# EAGLE design solar-shield (EAGLE 7.5.0)
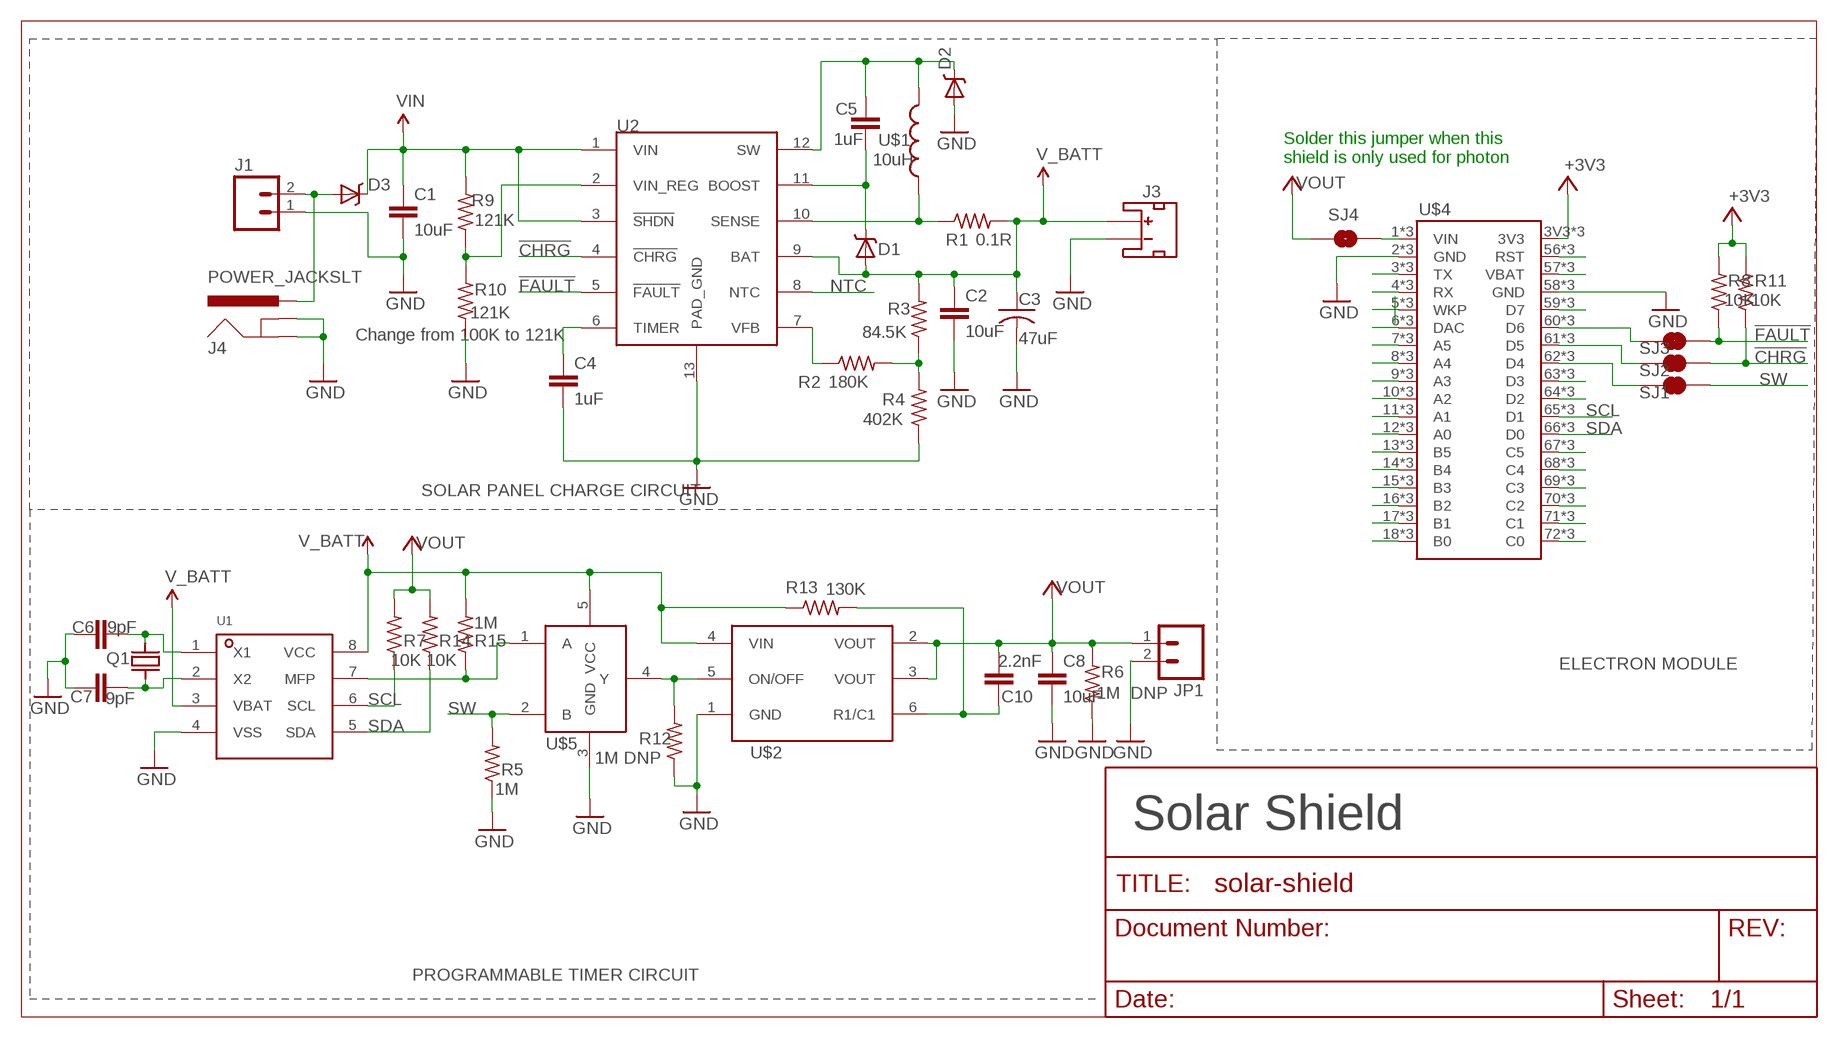
[diagram p0: schematic, sheet 1]

## Parts
C1  10uF  CAP_NONE_POLB  [1206]
C2  10uF  CAP_NONE_POLB  [1206]
C3  47uF  C-USB  [47U_TAN]
C4  1uF  CAP_NONE_POL  [0603]
C5  1uF  CAP_NONE_POL  [0603]
C6  9pF  CAP_NONE_POL  [0603]
C7  9pF  CAP_NONE_POL  [0603]
C8  10uF  CAP_NONE_POLA  [0805]
C10  2.2nF  CAP_NONE_POL  [0603]
D1  DIODE_SCHOTTKYD  [DIODE_SOD323]
D2  DIODE_SCHOTTKYA  [DIODE_SMA]
D3  DIODE_SCHOTTKYA  [DIODE_SMA]
J1  M025MM  [SCREWTERMINAL-5MM-2]
J3  JST_2MM_MALEA  [JST_2_MSD_VERT]
J4  POWER_JACKSLT  [POWER_JACK_SLOT]
JP1  M02PTH  [1X02]
Q1  Q_FC135  [FC135]
R1  0.1R  R-US_B  [R0805]
R2  180K  R_0603  [0603]
R3  84.5K  R_0603  [0603]
R4  402K  R_0603  [0603]
R5  1M  R_0603  [0603]
R6  1M DNP  R_0603  [0603]
R7  10K  R_0603  [0603]
R8  10K  R_0603  [0603]
R9  121K  R_0603  [0603]
R10  121K  R_0603  [0603]
R11  10K  R_0603  [0603]
R12  1M DNP  R_0603  [0603]
R13  130K  R_0603  [0603]
R14  10K  R_0603  [0603]
R15  1M  R_0603  [0603]
SJ1  JUMPER-PAD-2-NC_BY_TRACE  [PAD-JUMPER-2-NC_BY_TRACE_YES_SILK]
SJ2  JUMPER-PAD-2-NC_BY_TRACE  [PAD-JUMPER-2-NC_BY_TRACE_YES_SILK]
SJ3  JUMPER-PAD-2-NC_BY_TRACE  [PAD-JUMPER-2-NC_BY_TRACE_YES_SILK]
SJ4  JUMPER-PAD-2-NO  [PAD-JUMPER-2-NO_NO_SILK]
U1  RTC_MCP7941X  [RTC_MCP7941X]
U2  LT3652A  [DFN_3X3]
U$1  10uH  INDUCTORR  [INDUCTOR_NR6045T100M]
U$2  TPS27082L  [TPS27082L]
U$4  ELECTRONDUALROW  [ELECTRON_DUAL-ROW]
U$5  SN74UP1G32A  [SN74UP1G32_DBV]

## Nets
!CHRG: R11.1 SJ2.2 U2.4(!CHRG)
!FAULT: R8.1 SJ3.2 U2.5(!FAULT)
+3V3: R8.2 R11.2 U$4.3V3 U$4.55(3V3) U$4.91(3V3)
GND: C1.2(CATHODE) C2.2(CATHODE) C3.C C4.2(CATHODE) C6.1(ANODE) C7.1(ANODE) C8.2(CATHODE) D2.ANODE J1.1 J3.GND(-) J4.GND@1(GNDBREAK) J4.GND@2(GND) JP1.2 R4.1 R5.1 R6.1 R10.1 R12.1 U1.4(VSS) U2.13(PAD_GND) U$2.1(GND) U$4.2(GND) U$4.38(GND) U$4.58(GND) U$4.94(GND) U$4.GND U$4.GND@2(GND) U$5.3(GND)
N$1: R2.2 R3.1 R4.2
N$2: C5.2(CATHODE) D1.CATHODE U2.11(BOOST)
N$4: R1.1 U2.10(SENSE) U$1.P$1
N$5: R2.1 U2.7(VFB)
N$6: D3.ANODE J1.2 J4.PWR
N$7: C5.1(ANODE) D2.CATHODE U2.12(SW) U$1.P$2
N$10: U$4.3(TX) U$4.39(TX) U$4.TX
N$11: U$4.4(RX) U$4.40(RX) U$4.RX
N$12: U$4.5(WKP) U$4.41(WKP) U$4.WKP
N$13: U$4.6(DAC) U$4.42(DAC) U$4.DAC
N$14: U$4.7(A5) U$4.43(A5) U$4.A5
N$15: U$4.8(A4) U$4.44(A4) U$4.A4
N$16: U$4.9(A3) U$4.45(A3) U$4.A3
N$17: U$4.10(A2) U$4.46(A2) U$4.A2
N$18: U$4.11(A1) U$4.47(A1) U$4.A1
N$19: U$4.12(A0) U$4.48(A0) U$4.A0
N$20: U$4.13(B5) U$4.49(B5) U$4.B5
N$21: U$4.14(B4) U$4.50(B4) U$4.B4
N$22: U$4.15(B3) U$4.51(B3) U$4.B3
N$23: U$4.16(B2) U$4.52(B2) U$4.B2
N$24: U$4.17(B1) U$4.53(B1) U$4.B1
N$25: U$4.18(B0) U$4.54(B0) U$4.B0
N$26: U$4.72(C0) U$4.108(C0) U$4.C0
N$27: U$4.71(C1) U$4.107(C1) U$4.C1
N$28: U$4.70(C2) U$4.106(C2) U$4.C2
N$29: U$4.69(C3) U$4.105(C3) U$4.C3
N$30: U$4.68(C4) U$4.104(C4) U$4.C4
N$31: U$4.67(C5) U$4.103(C5) U$4.C5
N$32: SJ4.2 U$4.1(VIN) U$4.37(VIN) U$4.VIN
N$34: U$4.64(D2) U$4.100(D2) U$4.D2
N$35: U$4.59(D7) U$4.95(D7) U$4.D7
N$36: U$4.57(VBAT) U$4.93(VBAT) U$4.VBAT
N$37: U$4.56(RST) U$4.92(RST) U$4.RST
N$38: SJ1.1 U$4.62(D4) U$4.98(D4) U$4.D4
N$41: SJ2.1 U$4.61(D5) U$4.97(D5) U$4.D5
N$42: SJ3.1 U$4.60(D6) U$4.96(D6) U$4.D6
N$43: C6.2(CATHODE) Q1.X2 U1.1(X1)
N$44: C10.1(ANODE) R13.2 U$2.6(R1/C1)
N$46: C7.2(CATHODE) Q1.X1 U1.2(X2)
N$49: R15.1 U1.7(MFP) U$5.1(A)
N$51: R12.2 U$2.5(ON/OFF) U$5.4(Y)
NTC: U2.8(NTC)
SCL: R7.1 U1.6(SCL) U$4.65(D1) U$4.101(D1) U$4.D1
SDA: R14.1 U1.5(SDA) U$4.66(D0) U$4.102(D0) U$4.D0
SET: R9.1 R10.2 U2.2(VIN_REG)
SW: R5.2 SJ1.2 U$5.2(B)
TCAL: U$4.63(D3) U$4.99(D3) U$4.D3
TIMER: C4.1(ANODE) U2.6(TIMER)
V_BATT: C2.1(ANODE) C3.A D1.ANODE J3.VCC(+) R1.2 R3.2 R13.1 R15.2 U1.3(VBAT) U1.8(VCC) U2.9(BAT) U$2.4(VIN) U$5.5(VCC)
VCC: C8.1(ANODE) C10.2(CATHODE) JP1.1 R6.2 R7.2 R14.2 SJ4.1 U$2.2(VOUT) U$2.3(VOUT) ; supply symbol labelled VOUT
VIN: C1.1(ANODE) D3.CATHODE R9.2 U2.1(VIN) U2.3(!SHDN!)
Unconnected: J3.P$1(PAD1) J3.P$2(PAD2)

## Notes on the sheet
- Solder this jumper when this
  shield is only used for photon
- Change from 100K to 121K
- SOLAR PANEL CHARGE CIRCUIT
- ELECTRON MODULE
- Solar Shield
- PROGRAMMABLE TIMER CIRCUIT

## Library data of the parts
C1 C2 C4-C8 C10 = Particle:CAP_NONE_POL
C3 = Particle:C-US: Capacitor
D1-D3 = Particle:DIODE_SCHOTTKY
J1 = SparkFun-Connectors:M02: Standard 2-pin 0.1" header. Use with - straight break away headers ( PRT-00116) - right angle break away headers (PRT-00553) - swiss pins (PRT-00743) - machine pins (PRT-00117) - female headers (PRT-00115) Molex polarized connector foot print use with: PRT-08233 with associated crimp pins and housings. 2.54_SCREWTERM for use with PRT-10571. 3.5mm Screw Terminal footprints for PRT-08084 5mm Screw Terminal footprints for use with PRT-08432; STOREFRONT_ID: PRT-08432
J3 = Particle:JST_2MM_MALE
J4 = Particle:POWER_JACK: Power Jack This is the standard 5.5mm barrel jack for power. The PTH is the most common, proven, reliable, footprint. The Slot footprint only works if the mill layer is transmitted to the PCB fab house so be warned. Spark Fun Electronics SKU : PRT-00119 SMT: CONN-08106 Mating wall wart : TOL-00298 (and others)
JP1 = SparkFun-Connectors:M02: Standard 2-pin 0.1" header. Use with - straight break away headers ( PRT-00116) - right angle break away headers (PRT-00553) - swiss pins (PRT-00743) - machine pins (PRT-00117) - female headers (PRT-00115) Molex polarized connector foot print use with: PRT-08233 with associated crimp pins and housings. 2.54_SCREWTERM for use with PRT-10571. 3.5mm Screw Terminal footprints for PRT-08084 5mm Screw Terminal footprints for use with PRT-08432
Q1 = Particle:Q
R1 = Particle:R-US_: 0402 Resistor
R2-R15 = Particle:R_0603
SJ1-SJ3 = SparkFun-Passives:JUMPER-PAD-2-NC_BY_TRACE
SJ4 = SparkFun-Passives:JUMPER-PAD-2-NO
U1 = Particle:RTC_MCP7941X
U2 = Particle:LT3652
U$1 = Particle:INDUCTOR
U$2 = Particle:TPS27082L
U$4 = Particle:ELECTRON
U$5 = Particle:SN74UP1G32

## Board
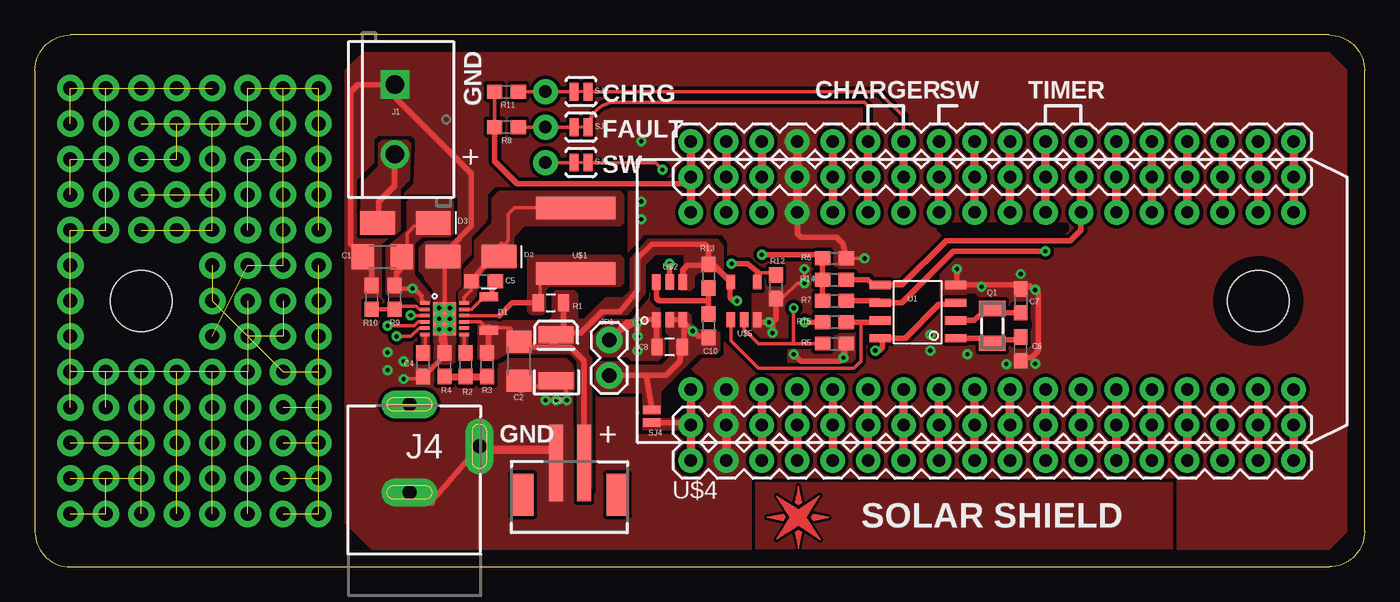
[diagram p1: board, top side]
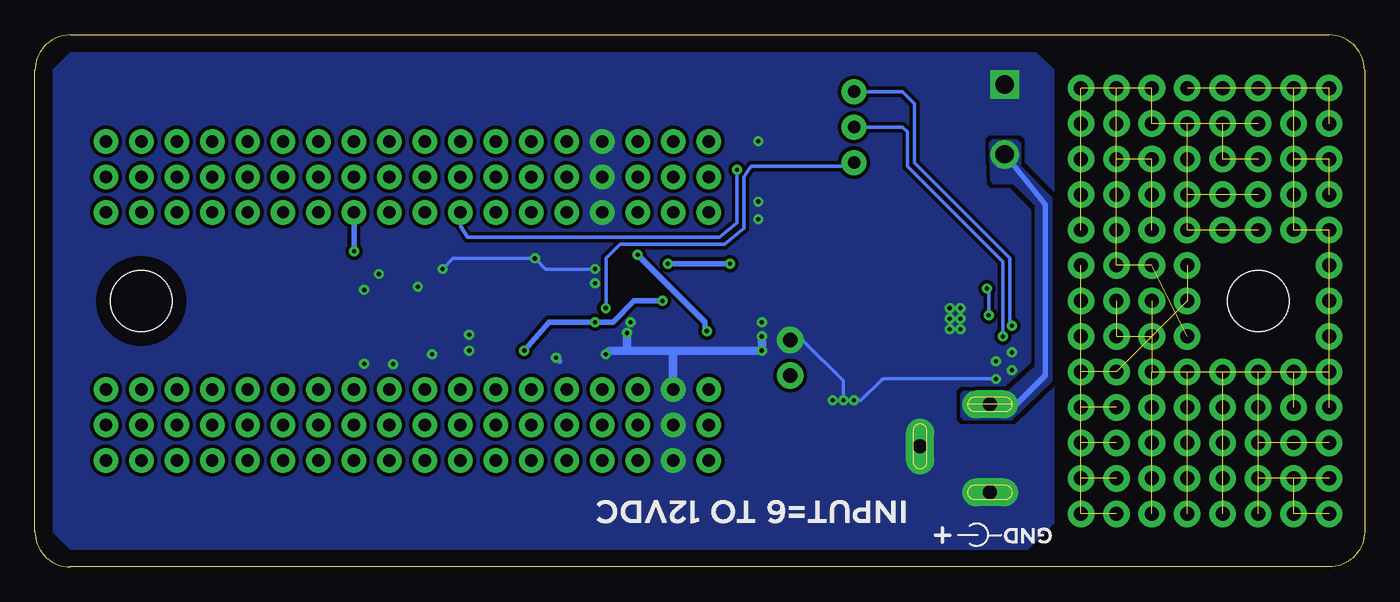
[diagram p2: board, bottom side, seen from below]

Size 95.25 x 38.1 mm. Coordinates in mm from the lower left corner, seen from the top.
Outline: 95.25,2.54 95.25,35.56 arc90 92.71,38.1 2.54,38.1 arc90 0,35.56 0,2.54 arc90 2.54,0 92.71,0 arc90 95.25,2.54
Copper layers (1*16): Top 0.035mm / dielectric 1.5mm / Bottom 0.035mm
Design rules "default *": minimum track width 10mil, minimum drill 24mil, track to track 8mil, track to pad 8mil, pad to pad 8mil, via to via 8mil, smd to smd 8mil, copper to edge 40mil, drill to drill 8mil, minimum pad ring 10mil, minimum via ring 8mil, stop-mask expansion 4mil, vias tented up to drill 20mil, thermal gap 10mil
Holes 4.4 mm at 7.62,19.05 87.63,19.05

### Footprints (pad centres in the part's own frame; a part is rotated, then mirrored left to right if it is on the bottom)
1206 = smd 1.6 x 1.8: 1 -1.4,0; 2 1.4,0
47U_TAN = smd 1.2 x 2.5: A 1.65,0; C -1.65,0
0603 = smd 1.1 x 1: 1 -0.85,0; 2 0.85,0
0805 = smd 0.8 x 1.2: 1 -0.9,0; 2 0.9,0
DIODE_SOD323 = smd 0.65 x 1.35: ANODE 1.2,0; CATHODE -1.2,0
DIODE_SMA = smd 2.5 x 1.7: ANODE 2,0; CATHODE -2,0
SCREWTERMINAL-5MM-2 = drill 1.3 pad 2.032 square: 1 0,0 | drill 1.3 pad 2.032: 2 5,0
JST_2_MSD_VERT = smd 1 x 5.5: GND 1.145,-0.965; VCC -0.855,-0.965 | smd 1.6 x 3: P$1 -3.255,1.305; P$2 3.545,1.305
POWER_JACK_SLOT = drill 1 pad 2 long: GND@1 2.58,7.5; GND@2 7.58,10.8; PWR 2.58,13.8
1X02 = drill 1.016 pad 1.88: 1 0,0; 2 2.54,0
FC135 = smd 1.1 x 1.9: X1 -1.25,0; X2 1.25,0
R0805 = smd 0.8 x 1.2: 1 -0.9,0; 2 0.9,0
PAD-JUMPER-2-NC_BY_TRACE_YES_SILK = smd 0.635 x 1.27: 1 -0.508,0; 2 0.508,0
PAD-JUMPER-2-NO_NO_SILK = smd 0.635 x 1.27: 1 -0.45,0; 2 0.45,0
RTC_MCP7941X = smd 0.6 x 1.55: 1 -1.905,-2.7; 2 -0.635,-2.7; 3 0.635,-2.7; 4 1.905,-2.7; 5 1.905,2.7; 6 0.635,2.7; 7 -0.635,2.7; 8 -1.905,2.7
DFN_3X3 = smd 0.25 x 0.7: 1 -1.125,-1.4; 2 -0.675,-1.4; 3 -0.225,-1.4; 4 0.225,-1.4; 5 0.675,-1.4; 6 1.125,-1.4; 7 1.125,1.4; 8 0.675,1.4; 9 0.225,1.4; 10 -0.225,1.4; 11 -0.675,1.4; 12 -1.125,1.4 | smd 2.38 x 1.65: 13 0,0
INDUCTOR_NR6045T100M = smd 1.6 x 5.7: P$1 -2.35,0; P$2 2.35,0
TPS27082L = smd 0.6 x 1.1: 1 -0.95,-1.35; 2 0,-1.35; 3 0.95,-1.35; 4 0.95,1.35; 5 0,1.35; 6 -0.95,1.35
ELECTRON_DUAL-ROW = drill 0.889 pad 1.753: 1 1.27,2.54; 2 3.81,2.54; 3 6.35,2.54; 3V3 1.27,22.86; 4 8.89,2.54; 5 11.43,2.54; 6 13.97,2.54; 7 16.51,2.54; 8 19.05,2.54; 9 21.59,2.54; 10 24.13,2.54; 11 26.67,2.54; 12 29.21,2.54; 13 31.75,2.54; 14 34.29,2.54; 15 36.83,2.54; 16 39.37,2.54; 17 41.91,2.54; 18 44.45,2.54; 37 1.27,7.62; 38 3.81,7.62; 39 6.35,7.62; 40 8.89,7.62; 41 11.43,7.62; 42 13.97,7.62; 43 16.51,7.62; 44 19.05,7.62; 45 21.59,7.62; 46 24.13,7.62; 47 26.67,7.62; 48 29.21,7.62; 49 31.75,7.62; 50 34.29,7.62; 51 36.83,7.62; 52 39.37,7.62; 53 41.91,7.62; 54 44.45,7.62; 55 1.27,20.32; 56 3.81,20.32; 57 6.35,20.32; 58 8.89,20.32; 59 11.43,20.32; 60 13.97,20.32; 61 16.51,20.32; 62 19.05,20.32; 63 21.59,20.32; 64 24.13,20.32; 65 26.67,20.32; 66 29.21,20.32; 67 31.75,20.32; 68 34.29,20.32; 69 36.83,20.32; 70 39.37,20.32; 71 41.91,20.32; 72 44.45,20.32; 91 1.27,25.4; 92 3.81,25.4; 93 6.35,25.4; 94 8.89,25.4; 95 11.43,25.4; 96 13.97,25.4; 97 16.51,25.4; 98 19.05,25.4; 99 21.59,25.4; 100 24.13,25.4; 101 26.67,25.4; 102 29.21,25.4; 103 31.75,25.4; 104 34.29,25.4; 105 36.83,25.4; 106 39.37,25.4; 107 41.91,25.4; 108 44.45,25.4; A0 29.21,5.08; A1 26.67,5.08; A2 24.13,5.08; A3 21.59,5.08; A4 19.05,5.08; A5 16.51,5.08; B0 44.45,5.08; B1 41.91,5.08; B2 39.37,5.08; B3 36.83,5.08; B4 34.29,5.08; B5 31.75,5.08; C0 44.45,22.86; C1 41.91,22.86; C2 39.37,22.86; C3 36.83,22.86; C4 34.29,22.86; C5 31.75,22.86; D0 29.21,22.86; D1 26.67,22.86; D2 24.13,22.86; D3 21.59,22.86; D4 19.05,22.86; D5 16.51,22.86; D6 13.97,22.86; D7 11.43,22.86; DAC 13.97,5.08; GND 8.89,22.86; GND@2 3.81,5.08; RST 3.81,22.86; RX 8.89,5.08; TX 6.35,5.08; VBAT 6.35,22.86; VIN 1.27,5.08; WKP 11.43,5.08
SN74UP1G32_DBV = smd 0.6 x 1.05: 1 -0.95,-1.35; 2 0,-1.35; 3 0.95,-1.35; 4 0.95,1.35; 5 -0.95,1.35

### Placement (x,y rotation side)
C1  24.89,22.23 180 top
C2  34.67,14.73 270 top
C3  37.34,14.99 90 top
C4  27.81,14.48 270 top
C5  32.13,20.45 0 top
C6  70.61,15.62 90 top
C7  70.61,19.05 270 top
C8  45.47,15.75 180 top
C10  48.26,17.27 270 top
D1  32.51,18.16 270 top
D2  31.24,22.23 180 top
D3  26.54,24.64 180 top
J1  25.78,34.54 270 top
J3  38.48,6.48 180 top
J4  24.26,-2.16 0 top
JP1  41.15,13.72 90 top
Q1  68.58,17.27 270 top
R1  36.96,18.92 0 top
R2  30.86,14.48 270 top
R3  32.38,14.48 90 top
R4  29.34,14.48 270 top
R5  57.28,16 180 top
R6  57.28,22.1 180 top
R7  57.28,19.05 180 top
R8  33.78,31.5 180 top
R9  25.78,19.3 90 top
R10  24.13,19.3 270 top
R11  33.78,34.04 180 top
R12  53.09,20.07 90 top
R13  48.26,20.83 270 top
R14  57.28,20.57 180 top
R15  57.28,17.53 180 top
SJ1  39.12,28.96 180 top
SJ2  39.12,34.04 180 top
SJ3  39.12,31.5 180 top
SJ4  44.2,10.79 270 top
U1  63.25,18.29 90 top
U2  29.34,17.78 270 top
U$1  38.73,23.37 90 top
U$2  45.47,19.05 0 top
U$3  [SPARK_LOGO_PLUS_PLANE]  54.69,3.56 0 top
U$4  45.72,5.08 0 top
U$5  50.8,19.05 0 top

### Tracks (layer width: path | path; a pad name or v marks a point on that pad's centre or on a via)
!CHRG  (via drill 0.3 pad 0.61, 0.9 pad 1.8)
  Top 0.254: U2.4 27.46,17.55 27.18,17.27 v25.27,17.27 | R11.1 v36.58,34.04 SJ2.2
  Bottom 0.254: v36.58,34.04 33.11,34.04 32.26,33.19 32.26,28.96 25.4,22.1 25.4,17.4 v25.27,17.27
!FAULT  (via drill 0.3 pad 0.61, 0.9 pad 1.8)
  Top 0.254: U2.5 27.52,17.11 26.92,16.51 v25.91,16.51 | SJ3.2 v36.58,31.5 R8.1
  Bottom 0.254: v25.91,16.51 25.91,21.84 32.77,28.7 32.77,31.15 33.11,31.5 v36.58,31.5
+3V3
  Top 0.254: R11.2 R8.2
  Top 0.406: 46.99,27.43 34.54,27.43 32.93,29.04 R8.2
  Top 0.61: U$4.91 U$4.3V3 46.99,27.43 U$4.55
GND  (via drill 0.3 pad 0.61)
  Top 0.025: R4.1 29.08,15.03
  Top 0.254: v59.44,22.1 R6.1 | R12.1 53.34,19.3 53.59,19.3 54.61,20.32 v55.12,20.32 v55.12,21.34 | 27.69,13.46 27.56,13.46 v26.42,13.46 | v36.58,11.94 v37.34,11.94 | v38.1,11.94 38.1,12.47 arc45 38.03,12.65 C3.C
  Top 0.305: U2.13 29.34,22.8 D2.ANODE | C3.C 34.79,12.57 C2.2 | R4.1 29.08,15.07 29.08,14.86 27.85,13.63 C4.2 27.73,13.63 27.56,13.46
  Top 0.406: R10.1 24.13,22.23 C1.2 22.61,23.11 22.61,34.04 23.11,34.54 J1.1 25.78,33.66 31.24,28.19 31.24,24.38 29.59,22.73 D2.ANODE | 50.04,12.95 49.78,12.95 U$4.38 | C6.1 70.83,14.99 71.37,14.99 71.88,15.49 71.88,19.56 71.29,20.15 C7.1 70.57,20.19 U1.4 66.04,20.29 v66.04,21.34 | C8.2 44.52,16.16 U$2.1 44.44,17.78 42.42,17.53 JP1.2 41.66,16.76 v43.18,17.53 v43.18,16.51 | J4.GND@1 26.83,4.57 28.45,4.57 28.45,4.74 J4.GND@2 31.96,8.01 32.34,8.38 | R6.1 57.87,23.15 57.4,23.62 54.86,23.62 54.61,23.88 54.61,25.65 | R12.1 53.09,17.78 52.83,17.53 | 52.83,17.53 51.92,17.53 | 51.92,17.53 U$5.3 51.75,17.59 51.82,17.53 51.92,17.53 | 52.83,17.53 v52.83,16.76 | R5.1 57.87,14.95 | v54.36,15.24 54.86,14.73 57.66,14.73 57.87,14.95 | 57.87,14.95 v57.91,14.99
  Top 0.61: U$4.94 U$4.GND 54.61,25.65 U$4.58 | U$4.38 U$4.GND@2 U$4.2 | J3.GND 37.34,8.13 37.08,8.38 32.34,8.38 | R4.1 29.08,17.53 U2.13
  Bottom 0.254: v66.04,21.34 65.28,22.1 v59.44,22.1 58.67,21.34 v55.12,21.34 | v26.42,13.46 34.44,13.46 arc-45 34.62,13.39 36.07,11.94 v36.58,11.94 | v38.1,11.94 v37.34,11.94 C3.C 40.18,16.18 arc-45 40.36,16.26 40.89,16.26
  Bottom 0.406: JP1.2 40.89,16.26 | v57.91,14.99 57.66,14.73
  Bottom 0.61: 49.66,15.49 v43.18,15.49 v43.18,16.51 | 49.66,15.49 52.83,15.49 | 52.83,15.49 54.1,15.49 v54.36,15.24 | v52.83,16.76 52.83,15.49 | U$4.38 49.53,15.37 49.66,15.49
  other vias: 67.82,20.07 66.8,15.24 28.96,18.54 29.72,18.54 29.72,17.78 28.96,17.78 28.96,17.02 29.72,17.02 52.58,17.53 26.42,14.73 25.27,15.37 25.27,14.1 43.43,30.48 64.14,16.64 64.14,15.49 43.43,30.48 43.43,26.16 43.43,24.89 70.61,20.98 71.65,14.55 69.6,14.53 71.65,19.84
  pour Top (no thermals): 24.77,35.69 26.42,35.69 32.26,28.96 32.26,24.64 31.24,23.62 31.24,22.35 30.48,21.59 30.48,20.07 30.1,19.68 30.1,16.13 29.84,15.88 29.84,14.73 28.83,14.73 28.83,15.88 28.57,16.13 28.57,19.81 27.94,20.57 27.94,22.86 30.48,22.86 30.48,28.19 25.53,33.27 24.77,33.27 24.51,33.53 24.51,35.43
  pour Top (no thermals): 33.78,14.35 38.35,14.35 38.61,14.1 38.61,12.7 37.85,11.68 37.85,6.6 37.08,5.84 36.83,5.84 36.83,10.67 35.81,11.68 34.29,11.68 33.53,12.45 33.53,14.1
  pour Top (no thermals): 27.94,22.86 27.94,23.11 28.19,23.37 29.97,23.37 30.48,23.88 30.48,22.86
  pour Top (isolate 0.254, rank 2, no thermals): 37.47,1.27 92.71,1.27 93.98,2.54 93.98,35.56 92.71,36.83 23.5,36.83 22.23,35.56 22.23,3.17 24.13,1.27
  pour Top (isolate 0.508, rank 2, no thermals): 31.75,36.83 92.71,36.83 93.98,35.56 93.98,2.54 92.71,1.27 24.13,1.27 22.86,2.54 22.23,3.17 22.23,35.56 23.5,36.83
  pour Bottom (isolate 0.254, rank 2, no thermals): 23.62,36.83 92.71,36.83 93.98,35.56 93.98,2.54 92.71,1.27 24.13,1.27 22.23,3.17 22.23,35.56 23.5,36.83
N$1
  Top 0.508: R4.2 R2.2 R3.1
N$2
  Top 0.254: C5.2 32.98,20.28 32.77,20.07 | D1.CATHODE 32.19,19.36 31.28,18.45 U2.11
  Top 0.406: 32.77,20.07 32.77,19.61 D1.CATHODE
N$4
  Top 0.254: U$1.P$1 37.86,21.02 37.86,20.7 36.2,20.7 36.2,19.06 R1.1 | U2.10 33.27,18
  Top 0.406: R1.1 34.19,18.92 33.27,18
  pour Top (no thermals): 35.56,22.35 41.91,22.35 42.16,22.1 42.16,20.32 41.91,20.07 36.83,20.07 36.58,19.81 36.58,18.29 36.32,18.03 35.56,18.03 35.31,18.29 35.31,22.1
N$5
  Top 0.254: U2.7 30.74,15.08
  Top 0.305: 30.74,15.08 R2.1
  pour Top (no thermals): 30.48,16.64 30.99,16.64 30.99,15.37 30.48,15.37
N$6
  Top 0.406: J1.2 25.78,27.3 24.64,26.16 24.64,24.73 D3.ANODE
  Bottom 0.406: J1.2 22.86,25.93 22.86,13.72 24.89,11.68 26.79,11.68 J4.PWR
  pour Top (no thermals): 24.89,30.61 26.67,30.61 26.92,30.35 26.8,27.69 26.16,27.05 26.16,24.13 25.91,23.88 23.62,23.88 23.37,24.13 23.37,27.43 24.64,28.7 24.64,30.35
  pour Bottom (no thermals): 24.89,30.61 26.67,30.61 26.92,30.35 26.8,27.69 26.54,27.43 25.15,27.43 23.62,25.91 23.62,14.35 25.53,12.57 28.7,12.57 28.96,12.32 28.96,10.79 28.7,10.54 25.27,10.54 22.35,13.34 22.35,26.42 24.64,28.7 24.64,30.35
N$7
  Top 0.254: U$1.P$2 34.35,25.72 33.91,25.27 33.91,23.4 D2.CATHODE | U2.12 30.74,19.31 31.24,19.81 31.24,20.41 C5.1
  Top 0.406: D2.CATHODE 33.44,23.11 C5.1
  pour Top (no thermals): 31.5,23.37 32.77,24.64 32.77,26.42 33.27,26.92 41.91,26.92 42.16,26.67 42.16,24.64 41.91,24.38 35.05,24.38 34.29,23.62 34.29,21.84 32.51,21.59 31.62,20.57 31.62,19.43 31.11,18.8 30.35,18.8 30.35,19.68 30.73,20.07 30.73,21.34 31.5,22.1
N$8
  Top 0.406: 49.53,12.83 49.53,12.95
N$10
  Top 0.61: U$4.39 U$4.TX U$4.3
N$11
  Top 0.61: U$4.40 U$4.RX U$4.4
N$12
  Top 0.61: U$4.41 U$4.WKP U$4.5
N$13
  Top 0.61: U$4.42 U$4.DAC U$4.6
N$14
  Top 0.61: U$4.43 U$4.A5 U$4.7
N$15
  Top 0.61: U$4.44 U$4.A4 U$4.8
N$16
  Top 0.61: U$4.45 U$4.A3 U$4.9
N$17
  Top 0.61: U$4.46 U$4.A2 U$4.10
N$18
  Top 0.61: U$4.47 U$4.A1 U$4.11
N$19
  Top 0.61: U$4.48 U$4.A0 U$4.12
N$20
  Top 0.61: U$4.49 U$4.B5 U$4.13
N$21
  Top 0.61: U$4.50 U$4.B4 U$4.14
N$22
  Top 0.61: U$4.51 U$4.B3 U$4.15
N$23
  Top 0.61: U$4.52 U$4.B2 U$4.16
N$24
  Top 0.61: U$4.53 U$4.B1 U$4.17
N$25
  Top 0.61: U$4.54 U$4.B0 U$4.18
N$26
  Top 0.61: U$4.108 U$4.C0 U$4.72
N$27
  Top 0.61: U$4.107 U$4.C1 U$4.71
N$28
  Top 0.61: U$4.106 U$4.C2 U$4.70
N$29
  Top 0.61: U$4.105 U$4.C3 U$4.69
N$30
  Top 0.61: U$4.104 U$4.C4 U$4.68
N$31
  Top 0.61: U$4.103 U$4.C5 U$4.67
N$32
  Top 0.406: SJ4.2 46.8,10.35 U$4.VIN
  Top 0.61: U$4.37 U$4.VIN U$4.1
  pour Top (no thermals): 43.56,10.67 46.99,10.67 46.99,9.78 43.56,9.78
N$33  (via drill 1 pad 1.9)  (14 unrouted)
  other vias: 20.32,13.97 20.32,11.43 20.32,8.89 20.32,6.35 20.32,3.81 17.78,3.81 17.78,6.35 17.78,8.89 17.78,11.43 17.78,13.97 20.32,19.05 20.32,16.51 12.7,21.59 12.7,19.05 20.32,21.59
N$34
  Top 0.61: U$4.100 U$4.D2 U$4.64
N$35
  Top 0.61: U$4.95 U$4.D7 U$4.59
N$36
  Top 0.61: U$4.93 U$4.VBAT U$4.57
N$37
  Top 0.61: U$4.92 U$4.RST U$4.56
N$38  (via drill 0.3 pad 0.61)
  Top 0.254: SJ1.1 44.45,28.96 v44.96,28.45
  Top 0.61: U$4.98 U$4.D4 U$4.62
  Bottom 0.254: U$4.62 64.77,24.38 64.26,23.62 46.23,23.62 44.96,24.64 v44.96,28.45
N$39  (via drill 1 pad 1.9)  (49 unrouted)
  other vias: 5.08,13.97 7.62,13.97 7.62,11.43 7.62,8.89 7.62,6.35 5.08,11.43 5.08,8.89 5.08,6.35 5.08,3.81 7.62,3.81 2.54,3.81 2.54,6.35 2.54,8.89 2.54,11.43 2.54,13.97 10.16,11.43 10.16,8.89 10.16,6.35 10.16,3.81 12.7,3.81 12.7,6.35 12.7,8.89 12.7,11.43 12.7,13.97 15.24,11.43 15.24,8.89 15.24,6.35 15.24,3.81 2.54,34.29 5.08,34.29 7.62,34.29 10.16,34.29 12.7,34.29 5.08,29.21 2.54,29.21 5.08,31.75 2.54,31.75 5.08,26.67 5.08,24.13 2.54,24.13 2.54,26.67 2.54,19.05 2.54,16.51 2.54,21.59 10.16,13.97 15.24,13.97 15.24,16.51 17.78,16.51 17.78,19.05 15.24,19.05
N$40  (via drill 1 pad 1.9)  (29 unrouted)
  other vias: 10.16,31.75 12.7,31.75 12.7,29.21 12.7,26.67 12.7,24.13 10.16,29.21 10.16,26.67 10.16,24.13 12.7,16.51 15.24,21.59 17.78,21.59 7.62,24.13 7.62,26.67 7.62,29.21 7.62,31.75 15.24,29.21 15.24,26.67 15.24,24.13 15.24,34.29 17.78,34.29 17.78,24.13 17.78,26.67 17.78,29.21 17.78,31.75 20.32,29.21 20.32,26.67 20.32,24.13 20.32,34.29 15.24,31.75 20.32,31.75
N$41
  Top 0.254: U$4.97 62.23,32.26 62.1,32.37 60.44,34.04 SJ2.1
  Top 0.61: U$4.97 U$4.D5 U$4.61
N$42
  Top 0.254: U$4.96 59.69,33.02 59.44,33.27 41.91,33.27 arc90 SJ3.1
  Top 0.61: U$4.96 U$4.D6 U$4.60
N$43
  Top 0.406: U1.1 68.22,16.38 Q1.X2 68.81,16.26 70.48,16.26 70.61,16.38 C6.2
N$44
  Top 0.406: R13.2 48.26,19.05 | 48.26,19.05 C10.1 | U$2.6 44.52,19.24 44.7,19.05 48.26,19.05
N$46
  Top 0.406: 68.65,18.45 Q1.X1 | U1.2 67.31,17.65 67.94,18.29 68.35,18.29 Q1.X1 | C7.2 68.9,18.2 Q1.X1
N$47
  cutout Top (no thermals): 50.55,16.51 50.8,16.51 51.69,15.75 53.85,15.75 53.85,14.48 52.07,14.48 50.29,16.26 50.29,16.76
N$48
  cutout Top: 62.23,18.54 64.77,21.08 64.77,19.05 64.52,19.05 62.1,16.76 61.47,16.76 61.47,18.29 61.72,18.54
N$49
  Top 0.254: U$5.1 49.85,16.19 51.82,14.22 58.67,14.22 59.18,14.73 59.18,17.53
  Top 0.406: U1.7 60.42,17.53 59.18,17.53 R15.1
N$50
  cutout Top: 50.8,21.59 51.31,21.08 51.31,18.29 50.8,18.29 50.8,19.3 50.55,19.56 50.55,20.83 50.29,21.08
N$51  (via drill 0.3 pad 0.61)
  Top 0.254: R12.2 53.34,20.83 53.09,21.08 51.82,21.08 51.75,21.15
  Top 0.406: U$2.5 v45.47,21.72 | v49.91,21.72 51.05,21.72 51.75,21.15 U$5.4
  Bottom 0.406: v45.47,21.72 v49.91,21.72
N$52
  cutout Top: 68.07,17.78 71.12,17.78 71.37,17.53 71.37,17.14 70.23,17.14 69.98,16.89 69.98,16.76 69.85,16.64 65.02,16.64 64.9,16.76 64.9,18.54 65.15,18.54 65.15,17.27 65.28,17.14 66.8,17.14 66.93,17.27 67.44,17.27 67.94,17.78
N$53
  cutout Top: 49.53,16.89 49.53,16.13 49.28,16.13 49.15,16.26 49.15,16.89
N$54
  cutout Top: 44.83,18.8 44.83,18.29 44.96,18.16 45.21,18.41 45.21,18.67 44.96,18.67
N$55
  cutout Top: 66.8,19.56 67.31,19.56 67.56,19.3 67.56,18.54 67.31,18.03 66.8,18.03
N$56
  cutout Top: 39.12,28.7 43.94,28.7 43.94,27.94 39.12,27.94
N$57
  cutout Top: 65.28,24.64 73.91,24.64 74.04,24.51 74.04,24.13 73.66,23.75 65.02,23.75 64.64,24.13 64.64,24.38 64.9,24.64 65.41,24.64
N$59
  cutout Top: 42.42,25.02 42.42,22.23 42.16,22.23 41.4,22.99 41.4,23.75 42.04,24.38 42.29,24.64 42.29,24.89
N$60
  cutout Top: 30.35,14.61 33.15,14.61 33.15,14.22 30.1,14.22 29.97,14.35 29.97,14.48 30.23,14.73
N$61
  cutout Top: 46.86,13.84 46.61,14.22 46.74,14.35 47.24,13.84 47.12,13.59
N$62
  cutout Top: 57.02,21.46 57.4,21.46 57.53,21.34 57.53,16.76 57.4,16.64 57.02,16.64
N$63
  pour Top: 51.66,6.07 81.48,6.07 81.48,1.27 51.66,1.27
SCL  (via drill 0.3 pad 0.61)
  Top 0.406: R7.1 60.42,19.05 U1.6 62.1,18.92 65.79,22.61 v72.39,22.61
  Top 0.61: U$4.101 U$4.D1 U$4.65
  Bottom 0.406: v72.39,22.61 U$4.65
SDA
  Top 0.406: U$4.66 74.93,24.13 74.17,23.37 65.28,23.37 62.1,20.19 U1.5 60.07,20.19 59.69,20.57 R14.1
  Top 0.61: U$4.102 U$4.D0 U$4.66
SET
  Top 0.254: U2.2 27.52,18.45 27.3,18.67 26,18.67 R9.1
  Top 0.305: R9.1 R10.2
SW  (via drill 0.3 pad 0.61, 0.9 pad 1.8)
  Top 0.254: 56.17,15.75 R5.2 54.36,16 | U$5.2 50.8,17.02 51.82,16 54.36,16 | SJ1.2 v36.58,28.96 | v54.36,18.54 54.36,16
  Bottom 0.254: v36.58,28.96 37.34,28.7 43.94,28.7 44.45,27.94 44.45,24.26 45.85,23.11 53.34,23.11 54.36,22.1 v54.36,18.54
TCAL
  Top 0.61: U$4.99 U$4.D3 U$4.63
TIMER
  Top 0.254: U2.6 27.94,15.32 C4.1
  pour Top (no thermals): 28.19,16.64 28.19,15.75 27.69,15.75 27.69,16.64
V_BATT  (via drill 0.3 pad 0.61)
  Top 0.025: R1.2 37.86,16.77 37.85,16.76
  Top 0.254: U2.9 31.92,17.55 D1.ANODE 32.84,17.14 33.91,17.14 34.04,17.02 34.04,16.38 34.42,16 C2.1
  Top 0.406: 32.51,17.21 D1.ANODE 32.51,15.58 R3.2 32.26,15.07 | C3.A 37.21,15.75 38.35,15.75 39.34,14.77 J3.VCC | U1.3 65.82,18.8 64.77,18.8 62.36,16.38 U1.8 60.71,16.22 60.71,15.75 60.45,15.49 v60.2,15.49 | 34.04,17.02 34.04,16 34.29,15.75 36.96,15.75 C3.A | U$2.4 46.42,21.27 46.74,21.59 48.17,21.59 R13.1 | R13.1 48.57,21.68 U$5.5 49.78,20.33 49.78,19.3 50.04,19.05 v50.29,19.05 | R15.2 v55.12,17.53 | R1.2 37.86,17.16 C3.A | 37.85,16.76 39.12,16.76 40.64,18.29 41.91,18.29 43.18,19.81 43.18,22.1 44.2,23.11 48.01,23.11 48.26,22.86 R13.1
  Bottom 0.406: v50.29,19.05 52.32,19.05 53.85,17.53 v55.12,17.53 58.42,17.53 v60.2,15.49
  pour Top (no thermals): 37.34,19.81 38.61,19.81 38.86,19.56 38.86,16 39.88,14.99 39.88,5.59 39.37,5.08 39.37,9.65 38.86,10.16 38.86,14.73 38.35,15.24 33.78,15.24 33.15,14.86 31.75,14.86 31.75,17.65 36.83,17.65 37.08,17.91 37.08,19.56
  pour Top (no thermals): 38.61,17.27 38.61,17.53 38.86,17.78 39.37,17.78 40.89,19.3 42.16,19.3 42.67,19.81 42.67,22.1 43.94,23.5 48.9,23.5 49.28,22.99 49.28,21.34 49.02,21.08 47.5,21.08 47.5,22.35 44.45,22.35 43.69,21.59 43.69,19.56 42.42,18.03 40.89,18.03 39.62,16.76 39.62,15.11 38.86,15.11 38.35,16.26 38.35,17.02
  pour Top (no thermals): 46.48,22.35 46.48,21.59 46.23,21.34 46.23,19.81 46.99,19.81 47.24,20.07 47.24,20.83 47.5,21.08 47.5,22.35
VCC  (via drill 0.3 pad 0.61)
  Top 0.406: 47.95,16.42 C10.2 48.17,16.51 47.5,16.51 v47.12,16.89 46.42,17.59 U$2.3 | U$2.2 U$2.3 | R7.2 R14.2 R6.2 55.92,22.35 v52.07,22.35 | U$2.3 46.48,17.63 46.48,16.26 46.1,15.88 C8.1 46.19,14.69 45.21,13.72 43.69,13.72 | JP1.1 43.69,13.72 | SJ4.1 43.81,13.59 43.69,13.72
  Bottom 0.406: v47.12,16.89 47.24,17.02 47.24,17.53 v52.07,22.35
  pour Top (no thermals): 45.34,18.29 46.74,18.29 46.99,18.03 46.99,17.53 47.5,17.02 48.77,17.02 49.02,16.76 49.02,15.49 48.77,15.24 47.5,15.24 44.7,12.45 40.64,12.45 40.13,12.95 40.13,14.48 40.39,14.73 42.16,14.73 42.42,14.48 44.96,14.48 45.47,14.99 45.47,16.51 45.21,16.76 45.21,18.16
  pour Top (no thermals): 44.83,12.95 44.83,11.43 43.56,11.43 43.56,12.95
VIN  (via drill 0.3 pad 0.61)
  Top 0.254: U2.3 26.95,18 v26.92,18.03 | D3.CATHODE 27.18,24.38 26.67,23.88 26.67,22.6 C1.1 | 27.69,19.43 27.69,19.16 U2.1
  Top 0.305: R9.2 26.07,19.94 v27.05,19.94 27.18,19.94 27.69,19.43
  Top 0.406: C1.1 26.8,21.97 25.91,21.08 25.91,20.28 R9.2
  Bottom 0.254: v26.92,18.03 26.92,19.81 v27.05,19.94
  pour Top (no thermals): 26.92,26.42 29.72,26.42 29.97,26.16 29.97,23.88 29.72,23.62 27.69,23.62 27.18,23.11 27.18,20.95 28.32,19.56 28.32,18.8 27.56,18.8 27.18,19.3 25.4,19.3 25.15,19.56 25.15,22.86 26.67,24.13 26.67,26.16

### Text on the board
tPlace: CHARGER | SW | TIMER | GND | CHRG | FAULT | SW | GND | + | SOLAR SHIELD
tDocu: Reference Designs ARE PROVIDED "AS IS" AND "WITH ALL FAULTS. PARTICLE INDUSTRIES, INC / ("PARTICLE") DISCLAIMS ALL OTHER WARRANTIES, EXPRESS OR IMPLIED, REGARDING / PRODUCTS OR THE REFERENCE DESIGNS, INCLUDING BUT NOT LIMITED TO, ANY / IMPLIED WARRANTIES OF MERCHANTABILITY, FITNESS FOR A PARTICULAR PURPOSE, / OR NON-INFRINGEMENT. / / Particle may make changes to specifications and product descriptions at any / time, without notice. The Customer must not rely on the absence or / characteristics of any features or instructions marked "reserved" or / "undefined." Particle reserves these for future definition and shall have / no responsibility whatsoever for conflicts or incompatibilities arising / from future changes to them. The product information on the Web Site or / Materials is subject to change without notice. Do not finalize a design / with this information. / Particle is a registered trademark.